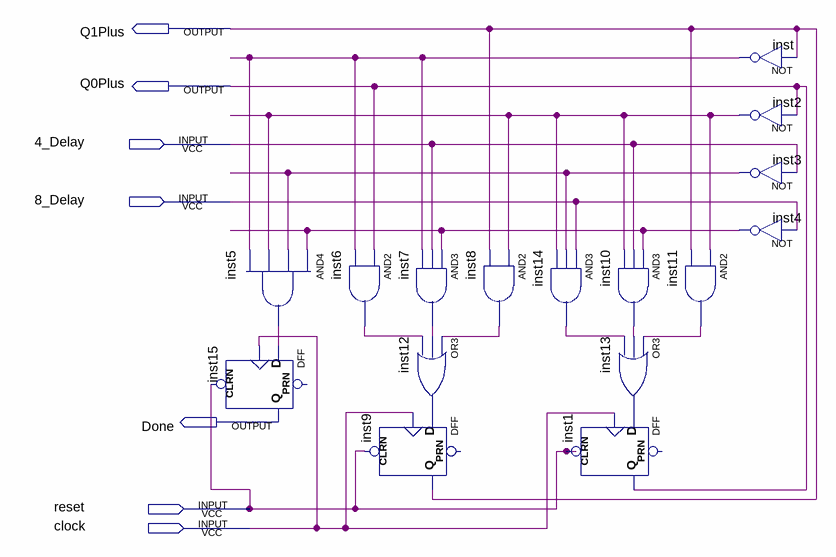
[diagram p0: schematic sheet]
// Quartus schematic Delay.bdf as structural Verilog: 16 symbols, 7 pins
module Delay (
  input  \4_Delay ,
  input  \8_Delay ,
  input  reset,
  input  clock,
  output Q1Plus,
  output Q0Plus,
  output Done
);

  wire inst2_out, inst3_out, inst4_out, inst5_out, inst6_out, inst7_out, inst8_out, inst10_out, inst11_out,
       inst12_out, inst13_out, inst14_out, inst_out;

  and inst5 (inst5_out, inst4_out, inst3_out, inst2_out, inst_out);
  DFF inst15 (.CLRN(reset), .CLK(clock), .D(inst5_out), .Q(Done));  // open: PRN
  and inst6 (inst6_out, Q0Plus, inst_out);
  DFF inst9 (.CLRN(reset), .CLK(clock), .D(inst12_out), .Q(Q1Plus));  // open: PRN
  and inst7 (inst7_out, inst4_out, \4_Delay , inst_out);
  or inst12 (inst12_out, inst8_out, inst7_out, inst6_out);
  and inst8 (inst8_out, inst2_out, Q1Plus);
  and inst14 (inst14_out, \8_Delay , inst3_out, inst2_out);
  and inst10 (inst10_out, inst4_out, \4_Delay , inst2_out);
  or inst13 (inst13_out, inst11_out, inst10_out, inst14_out);
  DFF inst1 (.CLRN(reset), .CLK(clock), .D(inst13_out), .Q(Q0Plus));  // open: PRN
  and inst11 (inst11_out, inst2_out, Q1Plus);
  not inst (inst_out, Q1Plus);
  not inst2 (inst2_out, Q0Plus);
  not inst3 (inst3_out, \4_Delay );
  not inst4 (inst4_out, \8_Delay );
endmodule
